# EAGLE schematic roboteq (EAGLE 6.2)
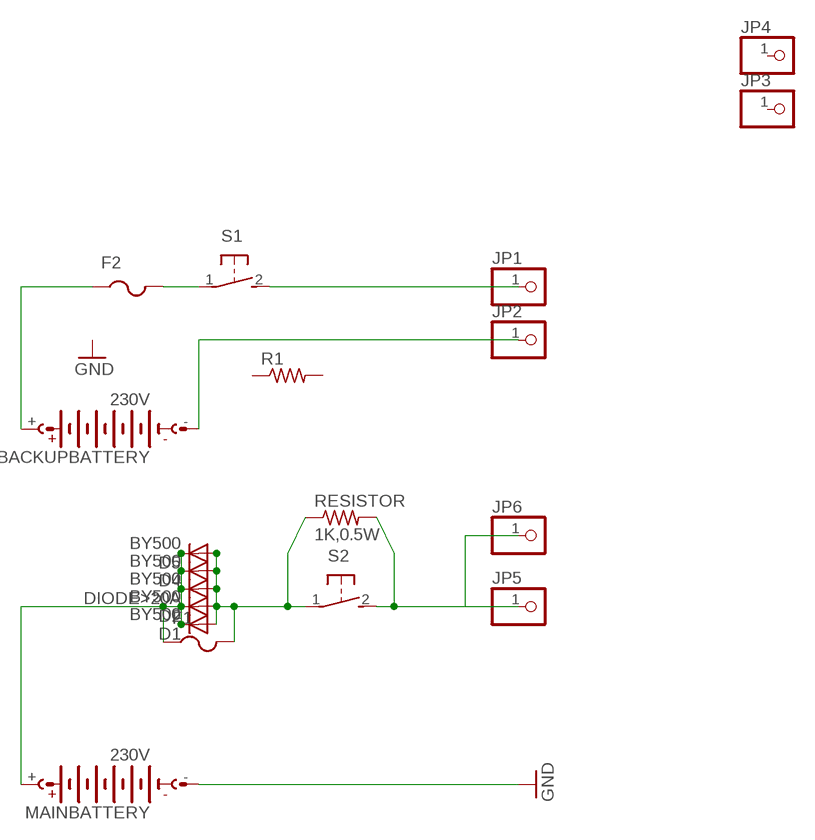
[diagram p0: schematic, sheet 1]

## Parts
BACKUPBATTERY  230V  AB9V  [AB9V]
D1  BY500  [DO201-15]
D2  BY500  [DO201-15]
D4  BY500  [DO201-15]
D5  BY500  [DO201-15]
DIODE>20A  BY500  [DO201-15]
F1  PTCFUSE-1206  [R1206]
F2  PTCFUSE-1206  [R1206]
JP1  PINHD-1X1  [1X01]
JP2  PINHD-1X1  [1X01]
JP3  PINHD-1X1  [1X01]
JP4  PINHD-1X1  [1X01]
JP5  PINHD-1X1  [1X01]
JP6  PINHD-1X1  [1X01]
MAINBATTERY  230V  AB9V  [AB9V]
R1  R-US_0204/5  [0204/5]
RESISTOR  1K,0.5W  R-US_0204/5  [0204/5]
S1  31-XX  [B3F-31XX]
S2  31-XX  [B3F-31XX]

## Nets
.: D1.C D2.C D4.C D5.C DIODE>20A.C F1.1 MAINBATTERY.+
GND: MAINBATTERY.-
N$2: D1.A D2.A D4.A D5.A DIODE>20A.A F1.2 RESISTOR.1 S2.1(P)
N$3: JP5.1 JP6.1 RESISTOR.2 S2.2(S)
N$4: BACKUPBATTERY.+ F2.1
N$5: F2.2 S1.1(P)
N$6: JP1.1 S1.2(S)
N$7: BACKUPBATTERY.- JP2.1
Unconnected: JP3.1 JP4.1 R1.1 R1.2

## Library data of the parts
BACKUPBATTERY MAINBATTERY = battery:AB9V: 9-V BATTERY CLIP
D1 D2 D4 D5 DIODE>20A = diode (2):BY500: DIODE fast recovery diode, 5 A, 800 V
F1 F2 = adafruit:PTCFUSE: PTC fuses, resettable thermistors
JP1-JP6 = adafruit:PINHD-1X1: Pin header 1x1 for 0.1" spacing With round pins
R1 RESISTOR = rcl:R-US_: RESISTOR, American symbol
S1 S2 = adafruit:31-XX: OMRON SWITCH Now with beefier pads!